# EAGLE schematic camera trigger control v1.0 (EAGLE 6.5.0)

## Sheet 1 of 3
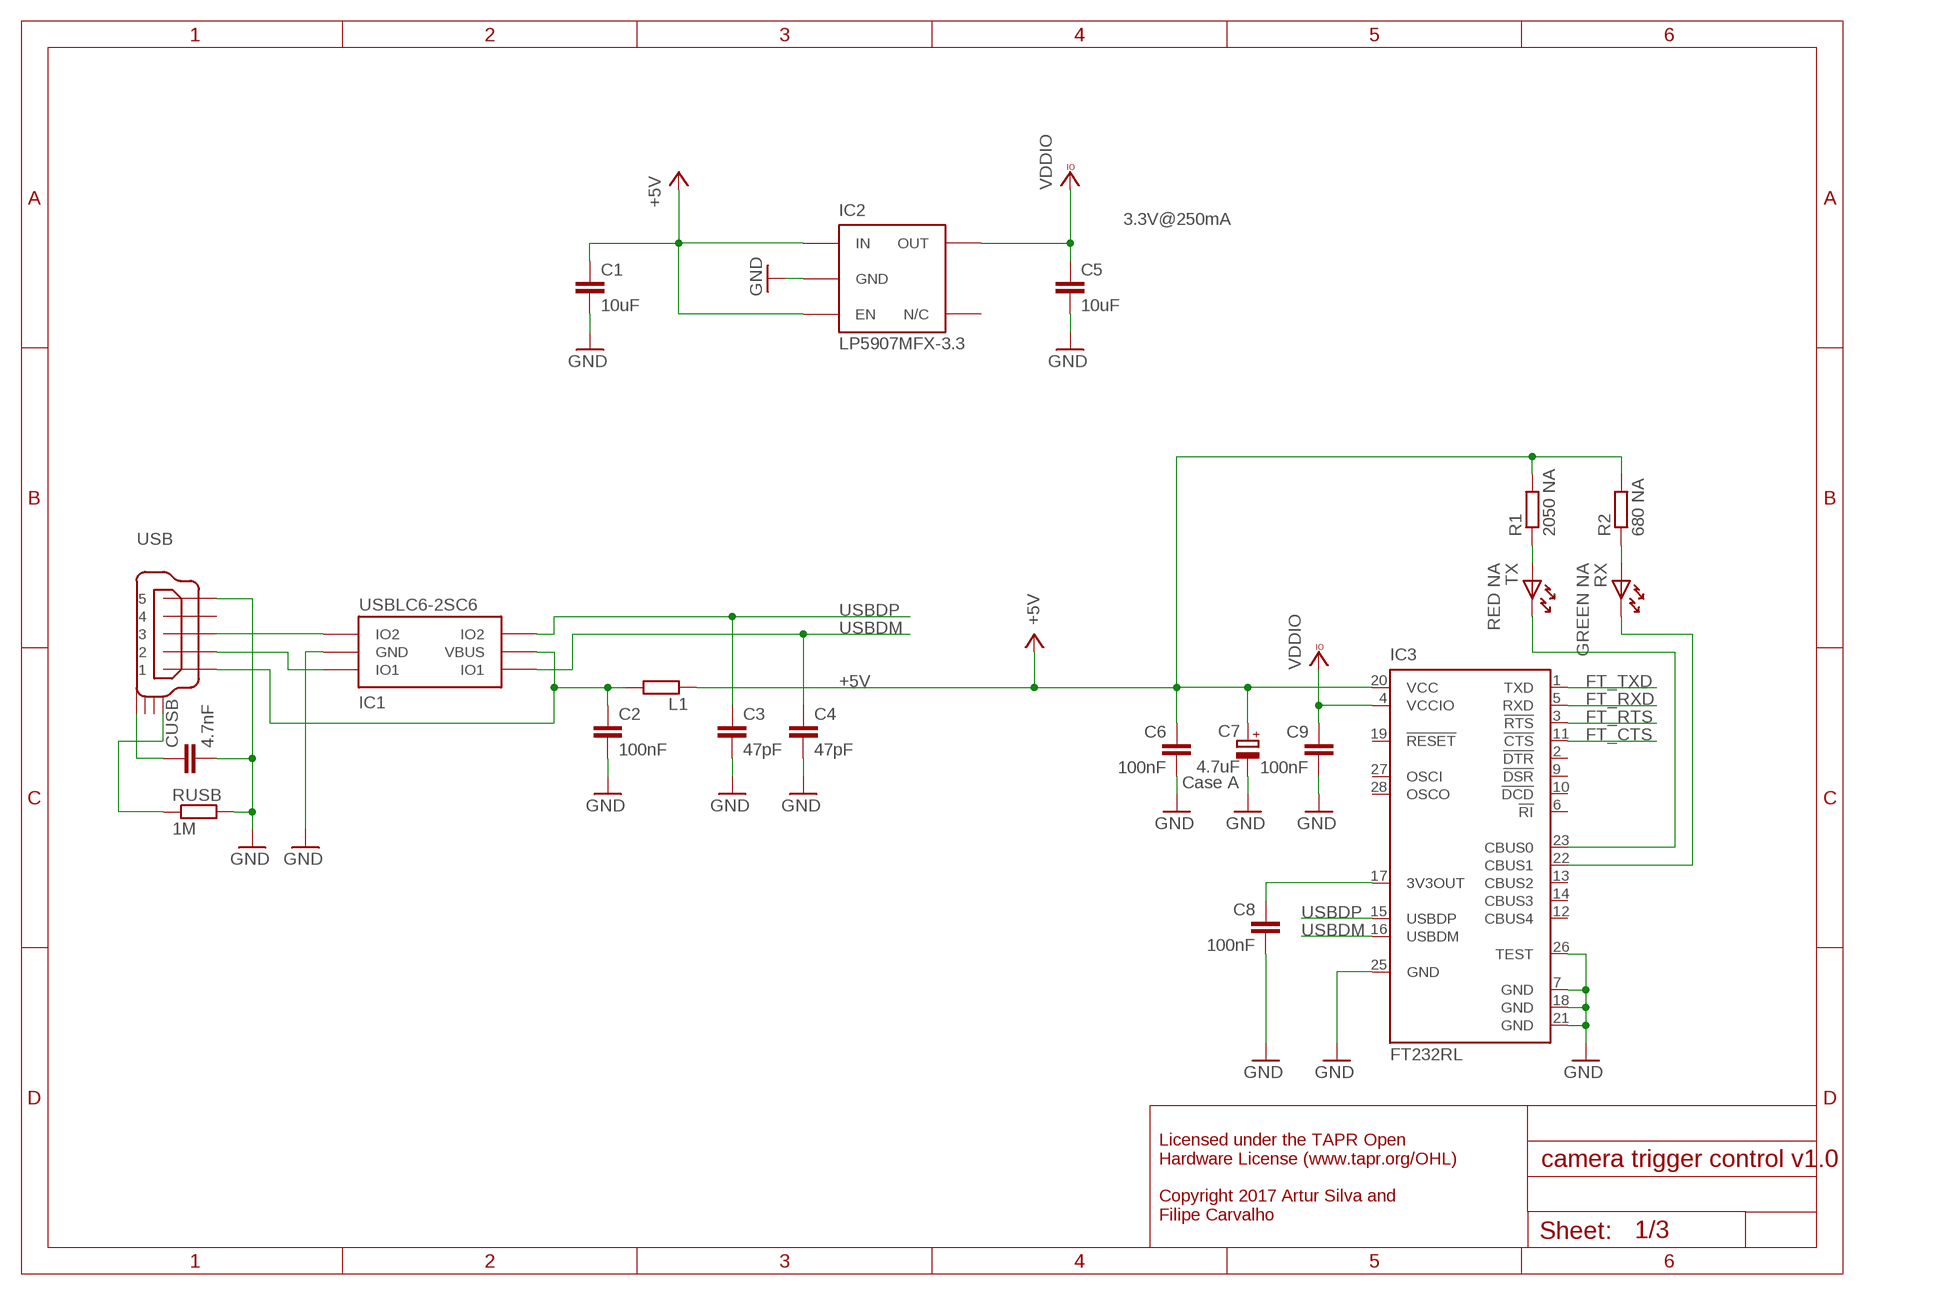
[diagram p0: schematic, sheet 1]

### Parts
C1  10uF  C-EUC0603  [C0603]
C2  100nF  C-EUC0402  [C0402]
C3  47pF  C-EUC0402  [C0402]
C4  47pF  C-EUC0402  [C0402]
C5  10uF  C-EUC0603  [C0603]
C6  100nF  C-EUC0402  [C0402]
C7  4.7uF  CPOL-EUA/3216-18W  [A/3216-18W]
C8  100nF  C-EUC0402  [C0402]
C9  100nF  C-EUC0402  [C0402]
CUSB  4.7nF  C-EUC0402  [C0402]
IC1  USBLC6-2SC6  USBLC6-2  [SOT23-6L]
IC2  LP5907MFX-3.3  TLV700XX  [TSOT23-5]
IC3  FT232RL  [SSOP28]
L1  ???  R-EU_R0805  [R0805]
R1  2050 NA  R-EU_R0402  [R0402]
R2  680 NA  R-EU_R0402  [R0402]
RUSB  1M  R-EU_R0402  [R0402]
RX  GREEN NA  LEDHAND  [LED_HAND]
TX  RED NA  LEDHAND  [LED_HAND]
USB  USB_MINI_B  [240-0002-1]

### Nets
+5V: C1.1 C6.1 C7.+ IC2.1(IN) IC2.3(EN) IC3.20(VCC) L1.1 R1.2 R2.2 ; also sheet 3
FT_CTS: IC3.11(!CTS) ; also sheet 2
FT_RTS: IC3.3(!RTS) ; also sheet 2
FT_RXD: IC3.5(RXD) ; also sheet 2
FT_TXD: IC3.1(TXD) ; also sheet 2
GND: C1.2 C2.2 C3.2 C4.2 C5.2 C6.2 C7.- C8.2 C9.2 CUSB.2 IC1.P$2(GND) IC2.2(GND) IC3.7(GND) IC3.18(GND) IC3.21(GND) IC3.25(GND) IC3.26(TEST) RUSB.2 USB.P$5 ; also sheet 2,3
N$38: C8.1 IC3.17(3V3OUT)
N$39: C2.1 IC1.P$5(VBUS) L1.2 USB.P$1
N$40: IC1.P$1(IO1) USB.P$2
N$47: R2.1 RX.A
N$48: IC3.23(CBUS0) TX.K
N$49: IC3.22(CBUS1) RX.K
N$50: IC1.P$3(IO2) USB.P$3
N$59: CUSB.1 USB.SHIELD_4
N$61: RUSB.1 USB.SHIELD_1
N$62: R1.1 TX.A
USBDM: C4.1 IC1.P$6(IO1) IC3.16(USBDM)
USBDP: C3.1 IC1.P$4(IO2) IC3.15(USBDP)
VCCIO: C5.1 C9.1 IC2.5(OUT) IC3.4(VCCIO) ; supply symbol labelled VDDIO ; also sheet 2,3
Unconnected: IC2.4(N/C) IC3.2(!DTR) IC3.6(!RI) IC3.9(!DSR) IC3.10(!DCD) IC3.12(CBUS4) IC3.13(CBUS2) IC3.14(CBUS3) IC3.19(!RESET) IC3.27(OSCI) IC3.28(OSCO) USB.P$4 USB.SHIELD_2 USB.SHIELD_3

### Notes on the sheet
- 3.3V@250mA
- Case A
- Licensed under the TAPR Open
  Hardware License (www.tapr.org/OHL)
  
  Copyright 2017 Artur Silva and 
  Filipe Carvalho

## Sheet 2 of 3
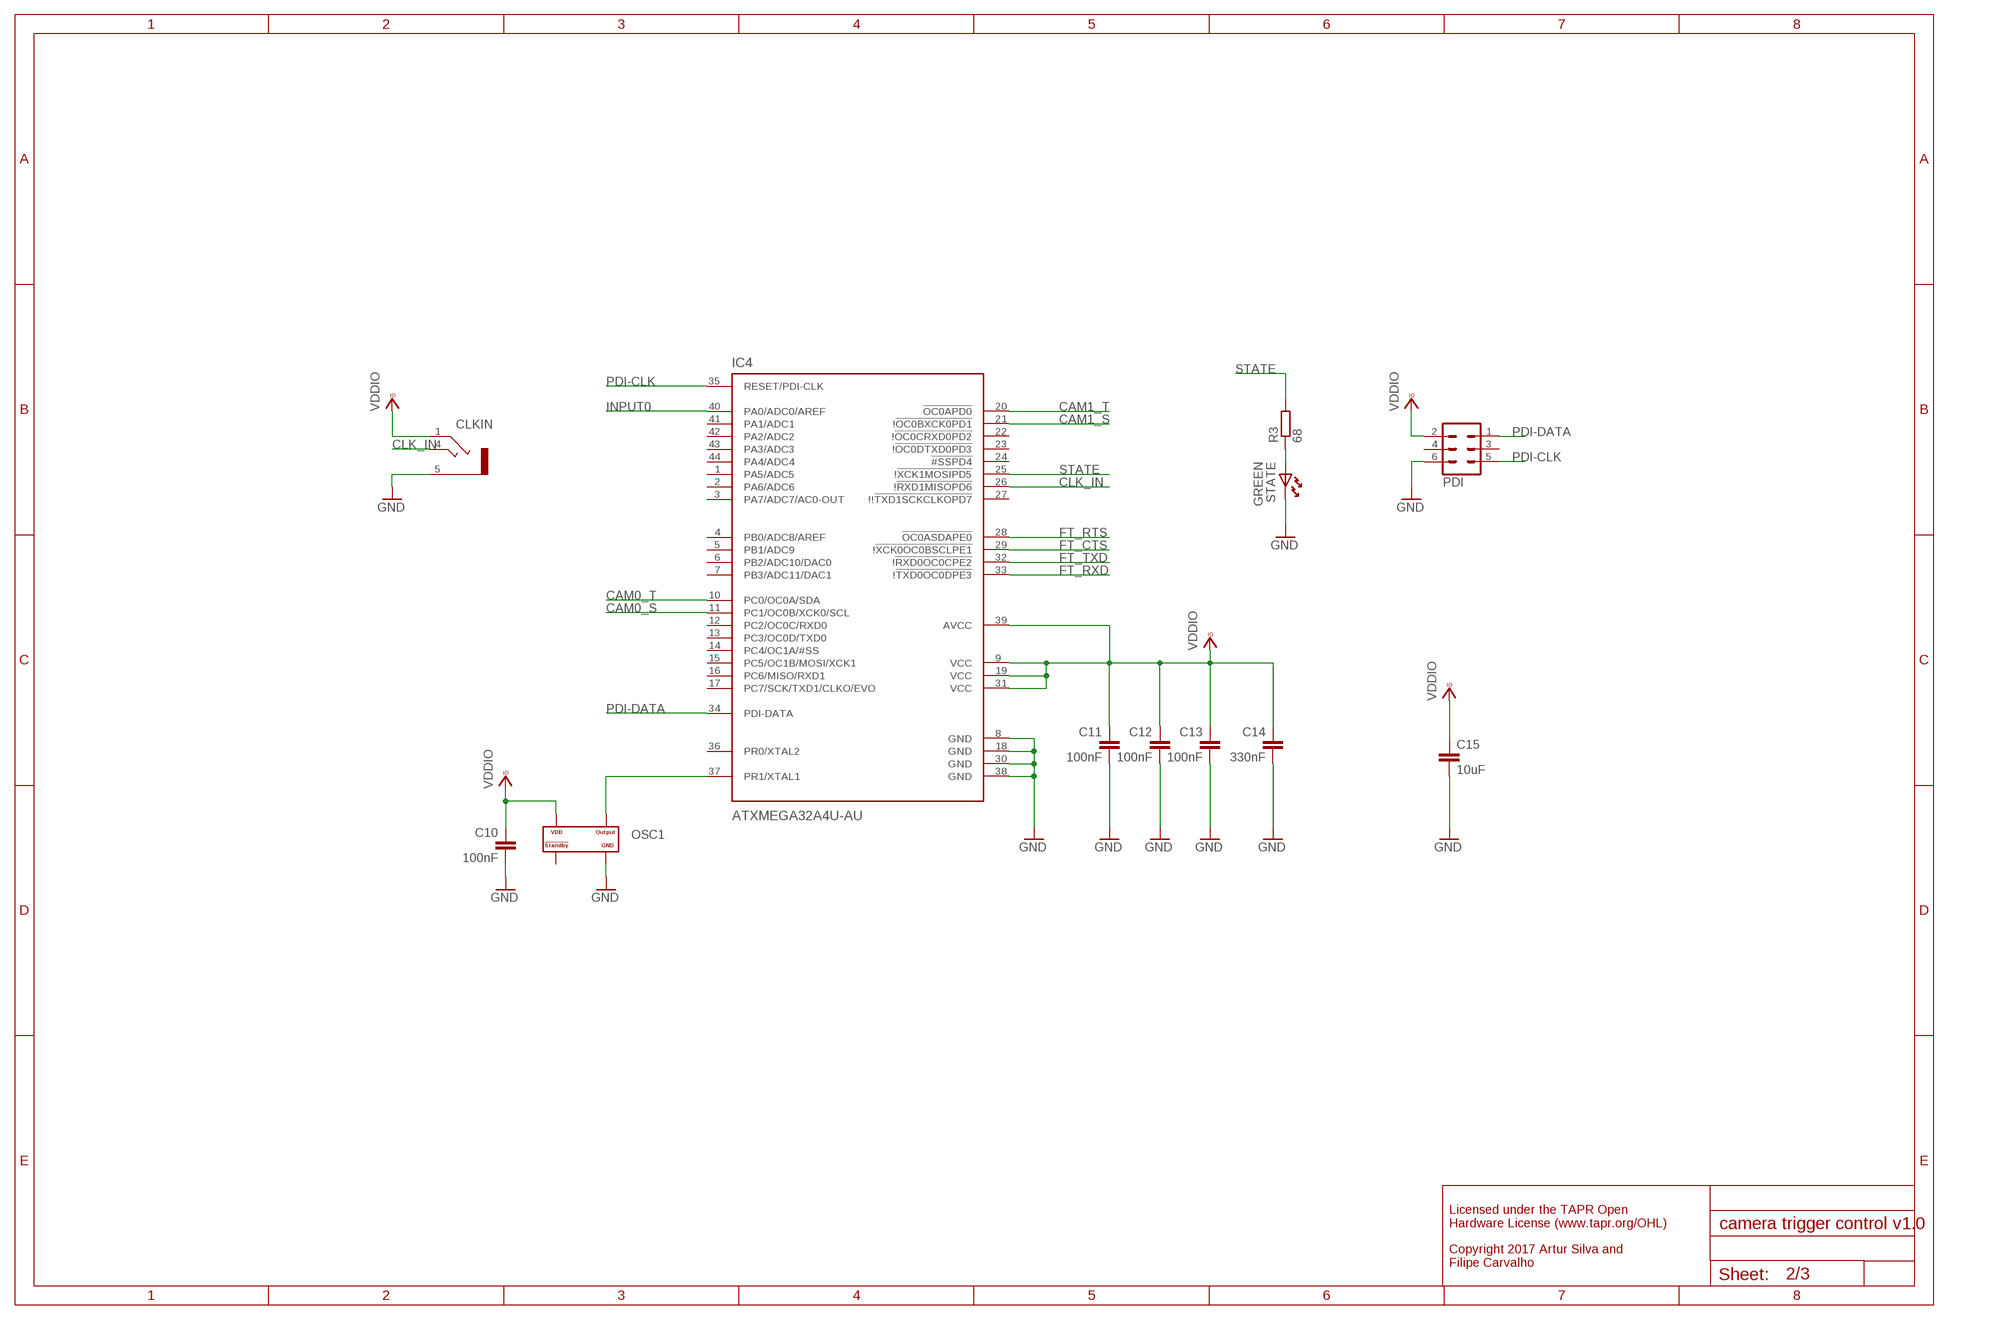
[diagram p1: schematic, sheet 2]

### Parts
C10  100nF  C-EUC0402  [C0402]
C11  100nF  C-EUC0402  [C0402]
C12  100nF  C-EUC0402  [C0402]
C13  100nF  C-EUC0402  [C0402]
C14  330nF  C-EUC0402  [C0402]
C15  10uF  C-EUC0603  [C0603]
CLKIN  STEREO_JACK  [35RASMT2BHNTRX]
IC4  ATXMEGA32A4U-AU  AT-XMEGA-XXA4-AU  [QFP80P1200X1200X120-44N]
OSC1  OSCILLATOR  [OSCILLATOR_3.2X2.5]
PDI  MA03-2  [MA03-2]
R3  68  R-EU_R0402  [R0402]
STATE  GREEN  LEDHAND  [LED_HAND]

### Nets
CAM0_S: IC4.11(PC1/OC0B/XCK0/SCL) ; also sheet 3
CAM0_T: IC4.10(PC0/OC0A/SDA) ; also sheet 3
CAM1_S: IC4.21(!!OC0BXCK0PD1) ; also sheet 3
CAM1_T: IC4.20(!OC0APD0) ; also sheet 3
CLK_IN: CLKIN.4 IC4.26(!!RXD1MISOPD6)
FT_CTS: IC4.29(!!XCK0OC0BSCLPE1) ; also sheet 1
FT_RTS: IC4.28(!OC0ASDAPE0) ; also sheet 1
FT_RXD: IC4.33(!!TXD0OC0DPE3) ; also sheet 1
FT_TXD: IC4.32(!!RXD0OC0CPE2) ; also sheet 1
GND: C10.2 C11.2 C12.2 C13.2 C14.2 C15.2 CLKIN.5 IC4.8(GND) IC4.18(GND) IC4.30(GND) IC4.38(GND) OSC1.P$2(GND) PDI.6 STATE.K ; also sheet 1,3
INPUT0: IC4.40(PA0/ADC0/AREF) ; also sheet 3
N$23: R3.1 STATE.A
OSC1: IC4.37(PR1/XTAL1) OSC1.P$3(OUTPUT)
PDI-CLK: IC4.35(RESET/PDI-CLK) PDI.5
PDI-DATA: IC4.34(PDI-DATA) PDI.1
STATE: IC4.25(!!XCK1MOSIPD5) R3.2
VCCIO: C10.1 C11.1 C12.1 C13.1 C14.1 C15.1 CLKIN.1 IC4.9(VCC) IC4.19(VCC) IC4.31(VCC) IC4.39(AVCC) OSC1.P$4(VDD) PDI.2 ; supply symbol labelled VDDIO ; also sheet 1,3
Unconnected: IC4.1(PA5/ADC5) IC4.2(PA6/ADC6) IC4.3(PA7/ADC7/AC0-OUT) IC4.4(PB0/ADC8/AREF) IC4.5(PB1/ADC9) IC4.6(PB2/ADC10/DAC0) IC4.7(PB3/ADC11/DAC1) IC4.12(PC2/OC0C/RXD0) IC4.13(PC3/OC0D/TXD0) IC4.14(PC4/OC1A/#SS) IC4.15(PC5/OC1B/MOSI/XCK1) IC4.16(PC6/MISO/RXD1) IC4.17(PC7/SCK/TXD1/CLKO/EVO) IC4.22(!!OC0CRXD0PD2) IC4.23(!!OC0DTXD0PD3) IC4.24(!#SSPD4) IC4.27(!!!TXD1SCKCLKOPD7) IC4.36(PR0/XTAL2) IC4.41(PA1/ADC1) IC4.42(PA2/ADC2) IC4.43(PA3/ADC3) IC4.44(PA4/ADC4) OSC1.P$1(STANDBY#) PDI.3 PDI.4

### Notes on the sheet
- Licensed under the TAPR Open
  Hardware License (www.tapr.org/OHL)
  
  Copyright 2017 Artur Silva and 
  Filipe Carvalho

## Sheet 3 of 3
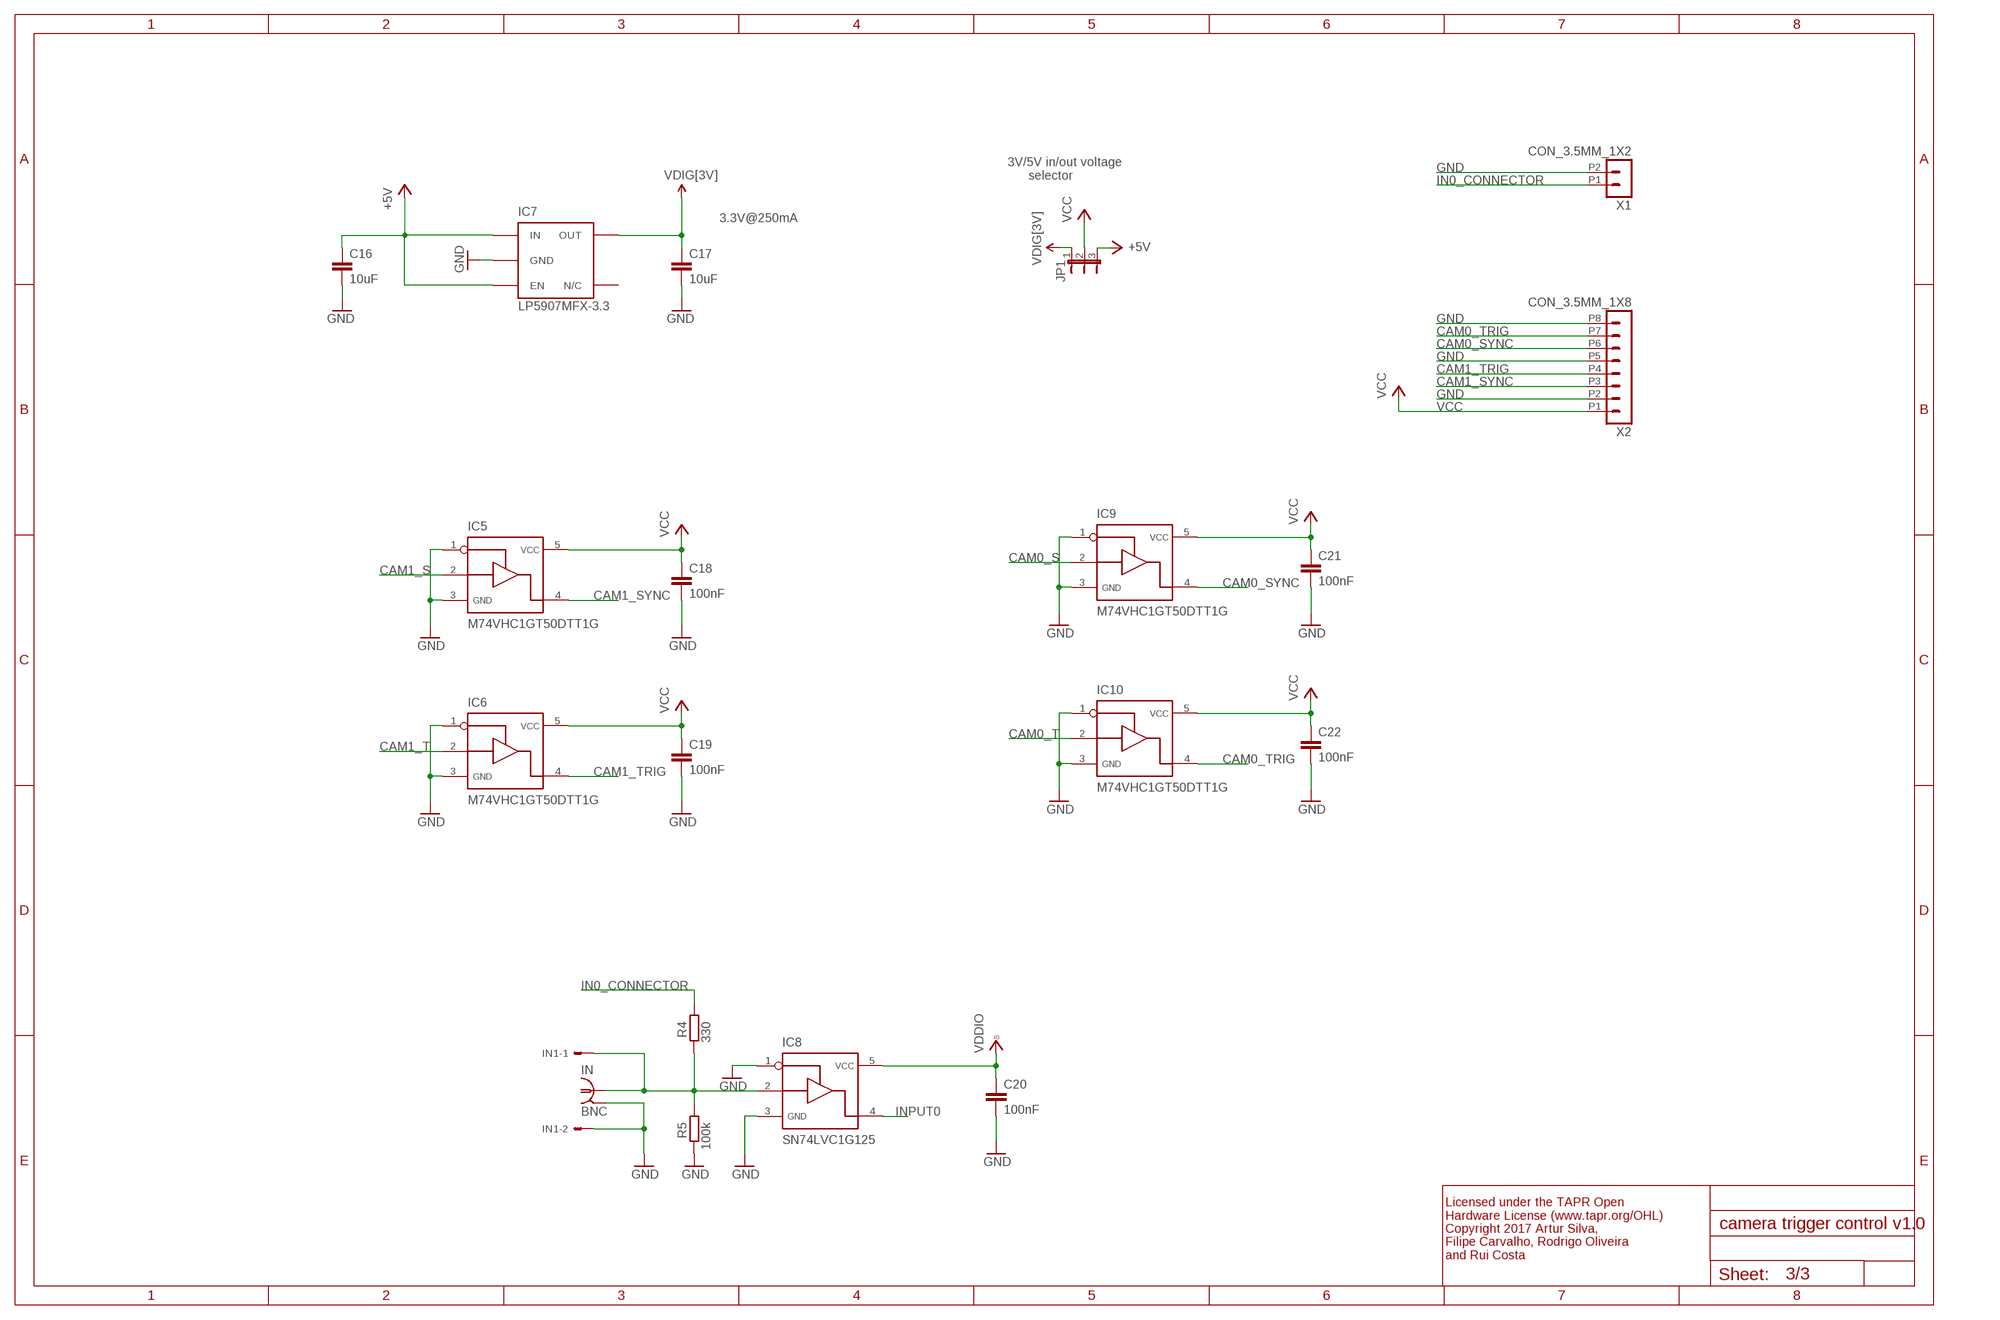
[diagram p2: schematic, sheet 3]

### Parts
C16  10uF  C-EUC0603  [C0603]
C17  10uF  C-EUC0603  [C0603]
C18  100nF  C-EUC0402  [C0402]
C19  100nF  C-EUC0402  [C0402]
C20  100nF  C-EUC0402  [C0402]
C21  100nF  C-EUC0402  [C0402]
C22  100nF  C-EUC0402  [C0402]
IC5  M74VHC1GT50DTT1G  SN74LVC1G125  [SOT23-5]
IC6  M74VHC1GT50DTT1G  SN74LVC1G125  [SOT23-5]
IC7  LP5907MFX-3.3  TLV700XX  [TSOT23-5]
IC8  SN74LVC1G125  [SOT23-5]
IC9  M74VHC1GT50DTT1G  SN74LVC1G125  [SOT23-5]
IC10  M74VHC1GT50DTT1G  SN74LVC1G125  [SOT23-5]
IN  BNC  [BNC_RA]
IN1  22-05-7028-02  [7395-02]
JP1  JP2E  [JP2]
R4  330  R-EU_R0402  [R0402]
R5  100k  R-EU_R0402  [R0402]
X1  CON_3.5MM_1X2  [CON_3.5MM_1X2]
X2  CON_3.5MM_1X8  [CON_3.5MM_1X8]

### Nets
+5V: C16.1 IC7.1(IN) IC7.3(EN) JP1.3 ; also sheet 1
CAM0_S: IC9.2 ; also sheet 2
CAM0_SYNC: IC9.4 X2.P6
CAM0_T: IC10.2 ; also sheet 2
CAM0_TRIG: IC10.4 X2.P7
CAM1_S: IC5.2 ; also sheet 2
CAM1_SYNC: IC5.4 X2.P3
CAM1_T: IC6.2 ; also sheet 2
CAM1_TRIG: IC6.4 X2.P4
GND: C16.2 C17.2 C18.2 C19.2 C20.2 C21.2 C22.2 IC5.1 IC5.3 IC6.1 IC6.3 IC7.2(GND) IC8.1 IC8.3 IC9.1 IC9.3 IC10.1 IC10.3 IN1.2 IN.2 R5.2 X1.P2 X2.P2 X2.P5 X2.P8 ; also sheet 1,2
IN0: IC8.2 IN1.1 IN.1 R4.2 R5.1
IN0_CONNECTOR: R4.1 X1.P1
INPUT0: IC8.4 ; also sheet 2
VCC: C18.1 C19.1 C21.1 C22.1 IC5.5 IC6.5 IC9.5 IC10.5 JP1.2 X2.P1
VCCIO: C20.1 IC8.5 ; supply symbol labelled VDDIO ; also sheet 1,2
VDIG[3V]: C17.1 IC7.5(OUT) JP1.1
Unconnected: IC7.4(N/C)

### Notes on the sheet
- 3V/5V in/out voltage
        selector
- 3.3V@250mA
- Licensed under the TAPR Open
  Hardware License (www.tapr.org/OHL)
  Copyright 2017 Artur Silva, 
  Filipe Carvalho, Rodrigo Oliveira
  and Rui Costa

## Library data of the parts
C1-C6 C8-C22 CUSB = rcl:C-EU: CAPACITOR, European symbol
C7 = rcl:CPOL-EU: POLARIZED CAPACITOR, European symbol
CLKIN = CNP-connectors:STEREO_JACK
IC1 = CNP 2:USBLC6-2
IC2 IC7 = CNP:TLV700XX
IC3 = ftdichip:FT232R: Source: http://www.ftdichip.com/Documents/DataSheets/DS_FT232R_v104.pdf; MPN: FT232RL; OC_FARNELL: 1146032; OC_NEWARK: 91K9918
IC4 = xmega-a4:AT-XMEGA-XXA4-AU: ATxMega a4 Serie
IC5 IC6 IC8-IC10 = My_library 0v2:SN74LVC1G125
IN = CNP-connectors:BNC
IN1 = con-molex:22-?-02: CONNECTOR wire to board 2.54 mm (.1 inch) pitch header; OC_FARNELL: 9731601; OC_NEWARK: unknown
JP1 = jumper:JP2E: JUMPER
L1 R1-R5 RUSB = rcl:R-EU_: RESISTOR, European symbol
OSC1 = CNP-miscellaneous:OSCILLATOR
PDI = con-lstb:MA03-2: PIN HEADER; OC_FARNELL: unknown; OC_NEWARK: unknown
RX STATE TX = CNP-miscellaneous:LED
USB = CNP-connectors:USB_MINI_B
X1 = CNP-connectors:CON_3.5MM_1X2
X2 = CNP-connectors:CON_3.5MM_1X8